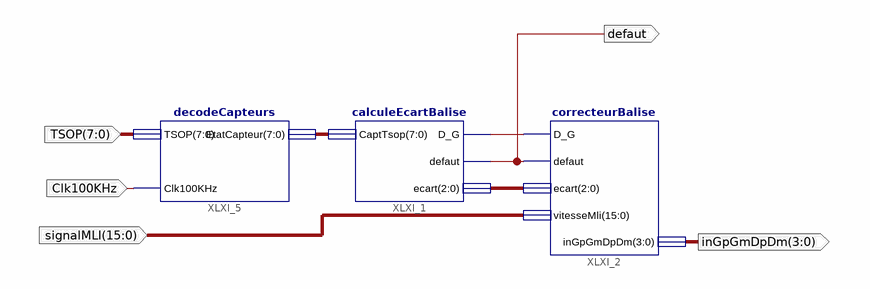
[diagram p0: schematic sheet 1]
// Xilinx ISE schematic suiviBalise.sch (spartan3a) as structural Verilog: 3 symbols, 5 ports
module suiviBalise (
  input  [15:0] signalMLI,
  input  [7:0] TSOP,
  input  Clk100KHz,
  output [3:0] inGpGmDpDm,
  output defaut
);

  wire XLXN_6;
  wire [2:0] XLXN_3;
  wire [7:0] XLXN_5;

  correcteurBalise XLXI_2 (
    .D_G(XLXN_6), .defaut(defaut), .ecart(XLXN_3), .vitesseMli(signalMLI), .inGpGmDpDm(inGpGmDpDm));
  calculeEcartBalise XLXI_1 (.CaptTsop(XLXN_5), .D_G(XLXN_6), .defaut(defaut), .ecart(XLXN_3));
  decodeCapteurs XLXI_5 (.TSOP(TSOP), .Clk100KHz(Clk100KHz), .EtatCapteur(XLXN_5));
endmodule
